# EAGLE design IRLocalization (EAGLE 9.6.2)
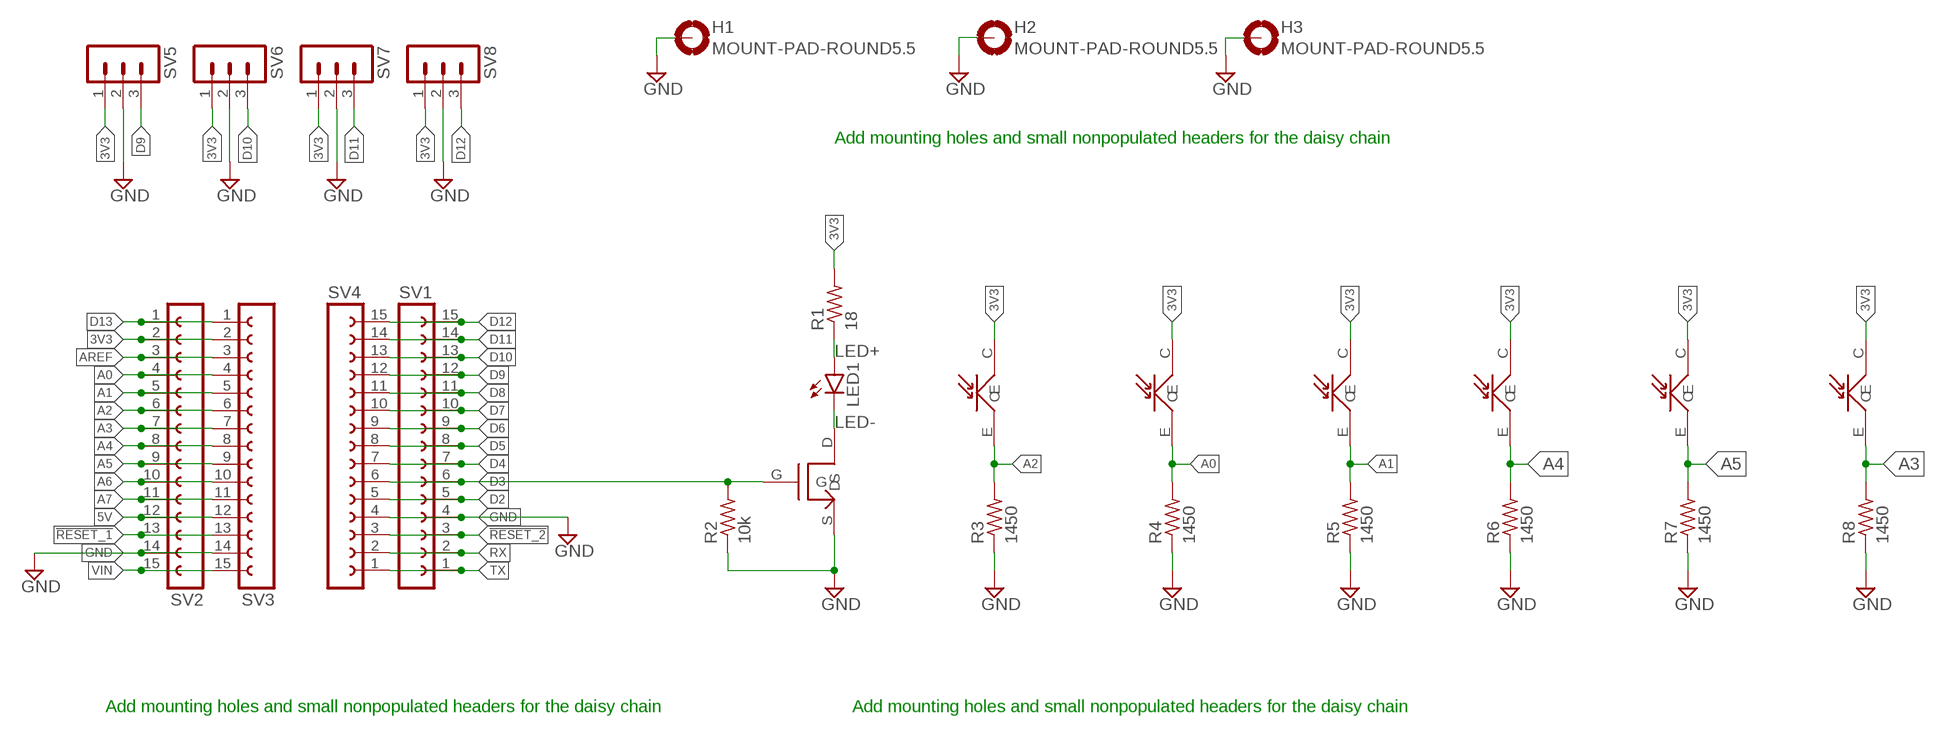
[diagram p0: schematic, sheet 1]

## Parts
H1  MOUNT-PAD-ROUND5.5  [5,5-PAD]
H2  MOUNT-PAD-ROUND5.5  [5,5-PAD]
H3  MOUNT-PAD-ROUND5.5  [5,5-PAD]
LED1  LED5MM  [LED5MM]
R1  18  R-US_R0603  [R0603]
R2  10k  R-US_R0603  [R0603]
R3  1450  R-US_R0603  [R0603]
R4  1450  R-US_R0603  [R0603]
R5  1450  R-US_R0603  [R0603]
R6  1450  R-US_R0603  [R0603]
R7  1450  R-US_R0603  [R0603]
R8  1450  R-US_R0603  [R0603]
SV1  FE15-1  [FE15]
SV2  FE15-1  [FE15]
SV3  FE15-1  [FE15]
SV4  FE15-1  [FE15]
SV5  MA03-1  [MA03-1]
SV6  MA03-1  [MA03-1]
SV7  MA03-1  [MA03-1]
SV8  MA03-1  [MA03-1]
U$1  NMOS_SOT23  [SOT23]
U$2  PHOTOTRANSISTOR_2.54  [2.54_TH]
U$3  PHOTOTRANSISTOR_2.54  [2.54_TH]
U$4  PHOTOTRANSISTOR_2.54  [2.54_TH]
U$5  PHOTOTRANSISTOR_2.54  [2.54_TH]
U$6  PHOTOTRANSISTOR_2.54  [2.54_TH]
U$7  PHOTOTRANSISTOR_2.54  [2.54_TH]

## Nets
3V3: R1.2 SV2.2 SV3.2 SV5.1 SV6.1 SV7.1 SV8.1 U$2.C U$3.C U$4.C U$5.C U$6.C U$7.C
5V: SV2.12 SV3.12
!RESET_1: SV2.13 SV3.13
!RESET_2: SV1.3 SV4.3
A0: R4.2 SV2.4 SV3.4 U$3.E
A1: R5.2 SV2.5 SV3.5 U$4.E
A2: R3.2 SV2.6 SV3.6 U$2.E
A3: R8.2 SV2.7 SV3.7 U$7.E
A4: R6.2 SV2.8 SV3.8 U$5.E
A5: R7.2 SV2.9 SV3.9 U$6.E
A6: SV2.10 SV3.10
A7: SV2.11 SV3.11
AREF: SV2.3 SV3.3
D2: SV1.5 SV4.5
D3: R2.2 SV1.6 SV4.6 U$1.G
D4: SV1.7 SV4.7
D5: SV1.8 SV4.8
D6: SV1.9 SV4.9
D7: SV1.10 SV4.10
D8: SV1.11 SV4.11
D9: SV1.12 SV4.12 SV5.3
D10: SV1.13 SV4.13 SV6.3
D11: SV1.14 SV4.14 SV7.3
D12: SV1.15 SV4.15 SV8.3
D13: SV2.1 SV3.1
GND: H1.B5,5(MOUNT) H2.B5,5(MOUNT) H3.B5,5(MOUNT) R2.1 R3.1 R4.1 R5.1 R6.1 R7.1 R8.1 SV1.4 SV2.14 SV3.14 SV4.4 SV5.2 SV6.2 SV7.2 SV8.2 U$1.S
LED+: LED1.A R1.1
LED-: LED1.K(C) U$1.D
RX: SV1.2 SV4.2
TX: SV1.1 SV4.1
VIN: SV2.15 SV3.15

## Notes on the sheet
- Add mounting holes and small nonpopulated headers for the daisy chain
- Add mounting holes and small nonpopulated headers for the daisy chain | Add mounting holes and small nonpopulated headers for the daisy chain

## Library data of the parts
H1-H3 = holes:MOUNT-PAD-ROUND: MOUNTING PAD, round
LED1 = led:LED: LED OSRAM: - CHIPLED LG R971, LG N971, LY N971, LG Q971, LY Q971, LO R971, LY R971 LH N974, LH R974 LS Q976, LO Q976, LY Q976 LO Q996 - Hyper CHIPLED LW Q18S LB Q993, LB Q99A, LB R99A - SideLED LS A670, LO A670, LY A670, LG A670, LP A670 LB A673, LV A673, LT A673, LW A673 LH A674 LY A675 LS A676, LA A676, LO A676, LY A676, LW A676 LS A679, LY A679, LG A679 - Hyper Micro SIDELED® LS Y876, LA Y876, LO Y876, LY Y876 LT Y87S - SmartLED LW L88C, LW L88S LB L89C, LB L89S, LG L890 LS L89K, LO L89K, LY L89K LS L896, LA L896, LO L896, LY L896 - TOPLED LS T670, LO T670, LY T670, LG T670, LP T670 LSG T670, LSP T670, LSY T670, LOP T670, LYG T670 LG T671, LOG T671, LSG T671 LB T673, LV T673, LT T673, LW T673 LH T674 LS T676, LA T676, LO T676, LY T676, LB T676, LH T676, LSB T676, LW T676 LB T67C, LV T67C, LT T67C, LS T67K, LO T67K, LY T67K, LW E67C LS E67B, LA E67B, LO E67B, LY E67B, LB E67C, LV E67C, LT E67C LW T67C LS T679, LY T679, LG T679 LS T770, LO T770, LY T770, LG T770, LP T770 LB T773, LV T773, LT T773, LW T773 LH T774 LS E675, LA E675, LY E675, LS T675 LS T776, LA T776, LO T776, LY T776, LB T776 LHGB T686 LT T68C, LB T68C - Hyper Mini TOPLED® LB M676 - Mini TOPLED Santana® LG M470 LS M47K, LO M47K, LY M47K Source: http://www.osram.convergy.de LUXEON: - LUMILED® LXK2-PW12-R00, LXK2-PW12-S00, LXK2-PW14-U00, LXK2-PW14-V00 LXK2-PM12-R00, LXK2-PM12-S00, LXK2-PM14-U00 LXK2-PE12-Q00, LXK2-PE12-R00, LXK2-PE12-S00, LXK2-PE14-T00, LXK2-PE14-U00 LXK2-PB12-K00, LXK2-PB12-L00, LXK2-PB12-M00, LXK2-PB14-N00, LXK2-PB14-P00, LXK2-PB14-Q00 LXK2-PR12-L00, LXK2-PR12-M00, LXK2-PR14-Q00, LXK2-PR14-R00 LXK2-PD12-Q00, LXK2-PD12-R00, LXK2-PD12-S00 LXK2-PH12-R00, LXK2-PH12-S00 LXK2-PL12-P00, LXK2-PL12-Q00, LXK2-PL12-R00 Source: www.luxeon.com KINGBRIGHT: KA-3528ASYC Source: www.kingbright.com
R1-R8 = resistor:R-US_: RESISTOR, American symbol
SV1-SV4 = con-lsta:FE15-1: FEMALE HEADER; OC_FARNELL: unknown; OC_NEWARK: unknown
SV5-SV8 = con-lstb:MA03-1: PIN HEADER; OC_FARNELL: unknown; OC_NEWARK: unknown
U$1 = IR_Localization:NMOS_SOT23
U$2-U$7 = IR_Localization:PHOTOTRANSISTOR_2.54

## Board
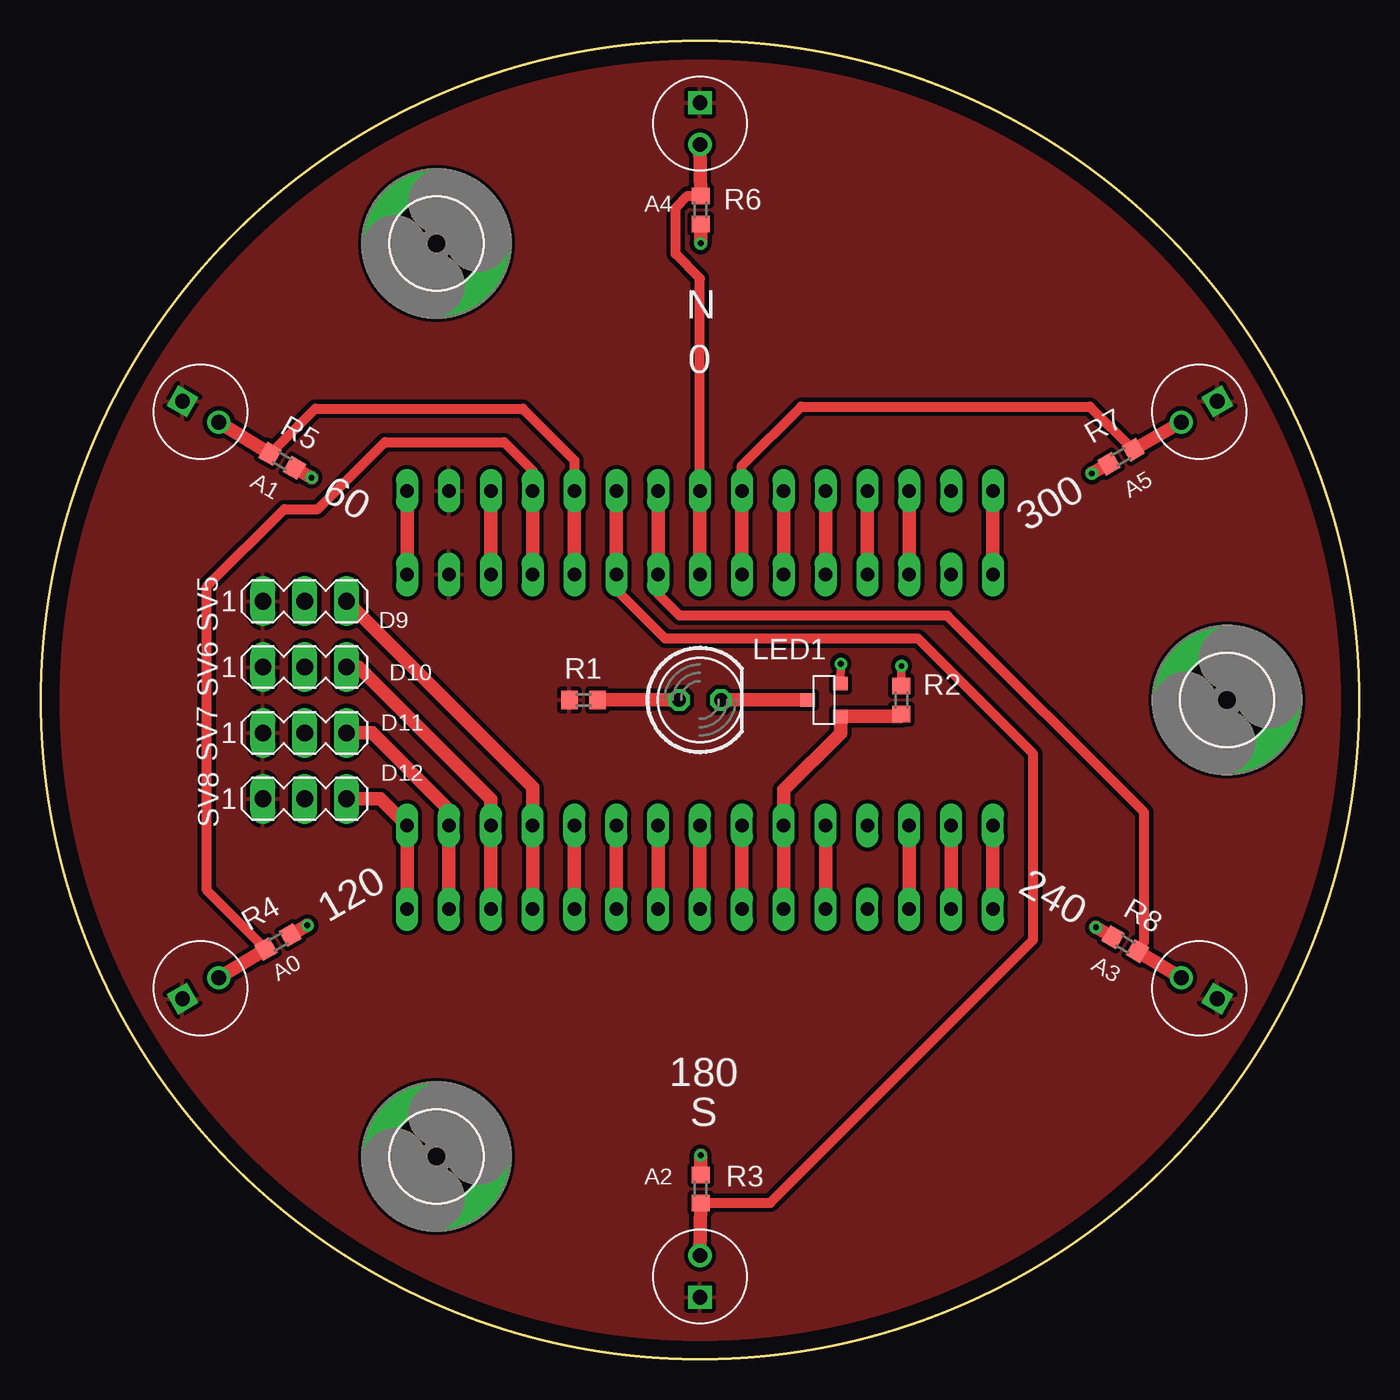
[diagram p1: board, top side]
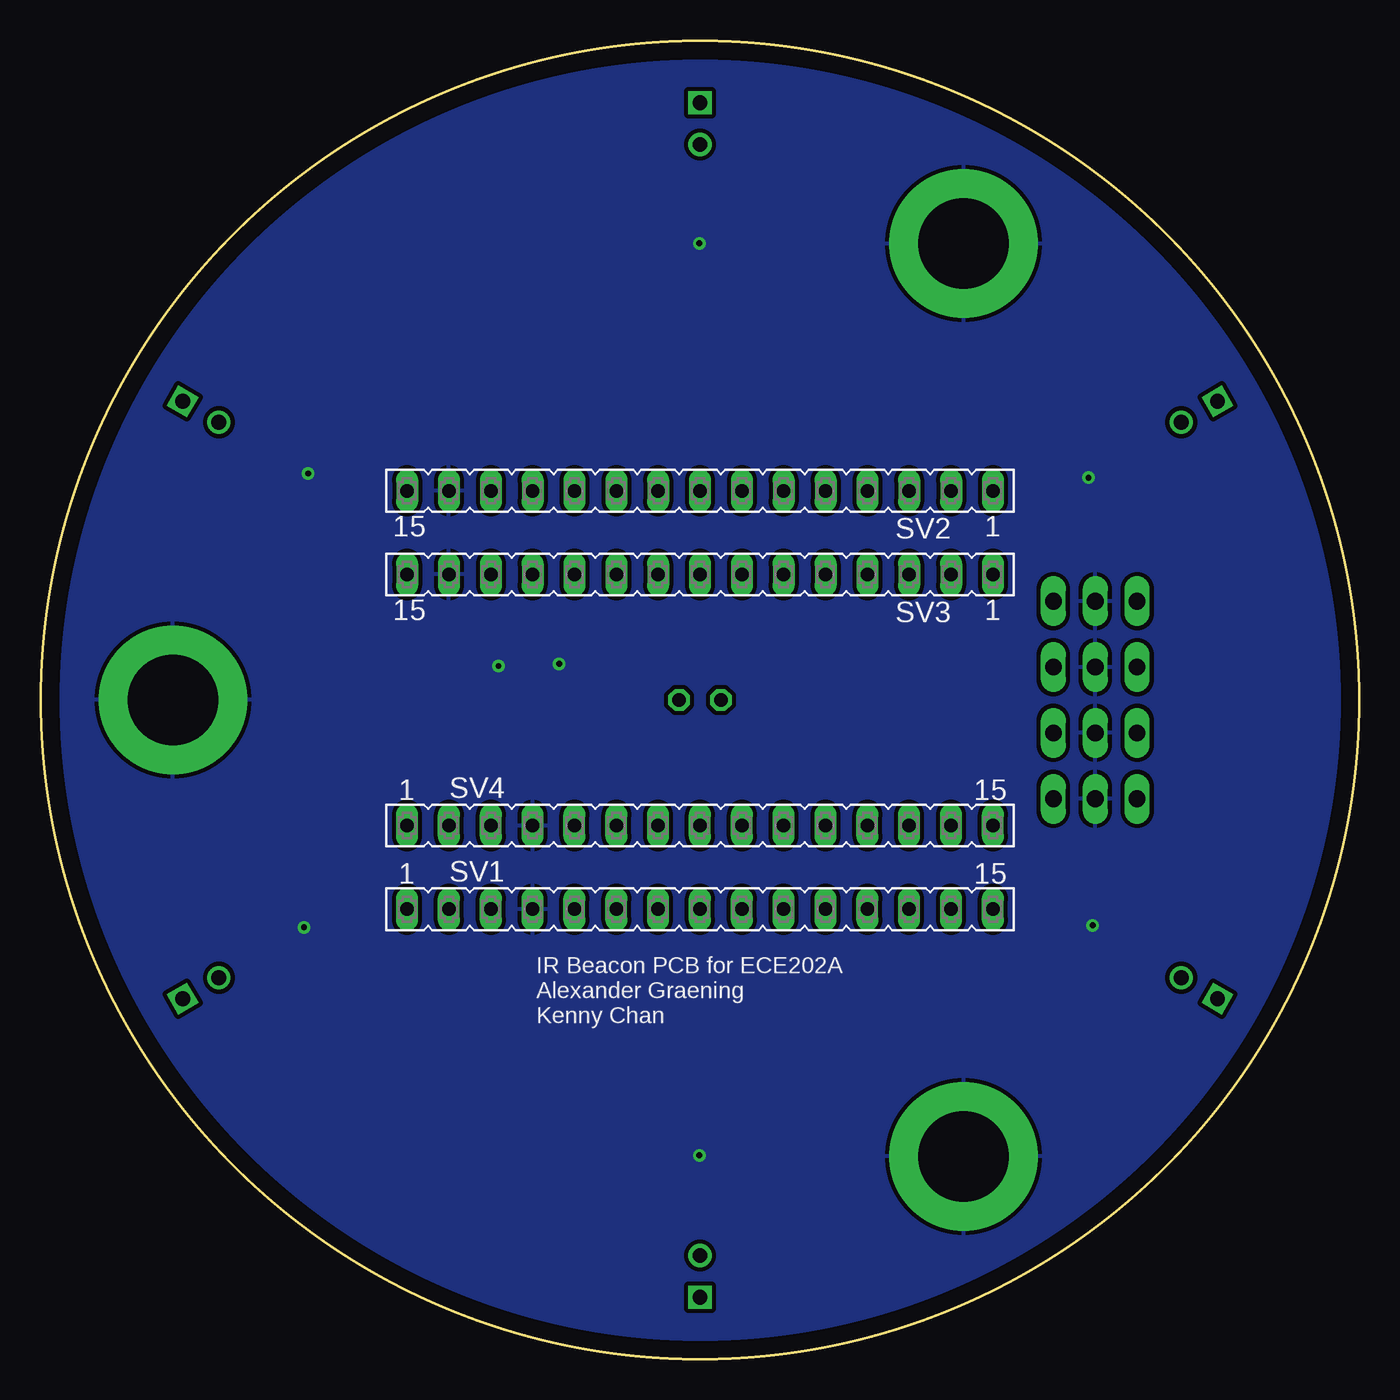
[diagram p2: board, bottom side, seen from below]

Size 80 x 80 mm. Coordinates in mm from the lower left corner, seen from the top.
Outline: circle at 40,40 radius 40
Copper layers (1*16): Top 0.035mm / dielectric 1.5mm / Bottom 0.035mm
Design rules "default *": minimum track width 6mil, minimum drill 0.35mm, track to track 10mil, track to pad 10mil, pad to pad 10mil, via to via 10mil, smd to smd 10mil, copper to edge 40mil, drill to drill 6mil, minimum pad ring 10mil, minimum via ring 8mil, stop-mask expansion 4mil, vias tented up to drill 0mil, thermal gap 10mil

### Footprints (pad centres in the part's own frame; a part is rotated, then mirrored left to right if it is on the bottom)
5,5-PAD = drill 5.5 pad 9: B5,5 0,0
LED5MM = drill 0.813 octagon: A -1.27,0; K 1.27,0
R0603 = smd 1 x 1.1: 1 -0.85,0; 2 0.85,0
FE15 = drill 0.813 long: 1 -17.78,0; 2 -15.24,0; 3 -12.7,0; 4 -10.16,0; 5 -7.62,0; 6 -5.08,0; 7 -2.54,0; 8 0,0; 9 2.54,0; 10 5.08,0; 11 7.62,0; 12 10.16,0; 13 12.7,0; 14 15.24,0; 15 17.78,0
MA03-1 = drill 1.016 long: 1 -2.54,0; 2 0,0; 3 2.54,0
SOT23 = smd 0.9 x 0.8: D -1,0; G 1,-1; S 1,1
2.54_TH = drill 0.9 square: C 0,1.27 | drill 0.9: E 0,-1.27

### Placement (x,y rotation side)
H1  24,12.29 0 top
H2  72,40 0 top
H3  24,67.71 0 top
LED1  40,40 0 top
R1  32.93,40 180 top
R2  52.23,40 270 top
R3  40.04,10.32 270 top
R4  14.38,25.31 210 top
R5  14.64,54.52 150 top
R6  40.04,69.76 90 top
R7  65.56,54.77 30 top
R8  65.82,25.18 330 top
SV1  40,27.3 0 bottom
SV2  40,52.7 180 bottom
SV3  40,47.62 180 bottom
SV4  40,32.38 0 bottom
SV5  16,46 0 top
SV6  16,42 0 top
SV7  16,38 0 top
SV8  16,34 0 top
U$1  47.53,40 0 top
U$2  40,5 180 top
U$3  9.68,22.5 120 top
U$4  9.68,57.5 60 top
U$5  40,75 0 top
U$6  70.31,57.5 300 top
U$7  70.31,22.5 240 top

### Tracks (layer width: path | path; a pad name or v marks a point on that pad's centre or on a via)
3V3
  pour Top: -0.09,40.04 -0.09,0.03 40.16,0.03 79.92,0.03 79.92,40.29 79.92,79.92 39.53,79.92 -0.09,79.92
5V
  Top 0.813: SV3.12 SV2.12
!RESET_1
  Top 0.813: SV2.13 SV3.13
!RESET_2
  Top 0.813: SV4.3 SV1.3
A0
  Top 0.61: R4.2 10.07,28.46 10.07,46.9 14.77,51.59 16.8,51.59 20.86,55.66 28.1,55.66 29.84,53.92 SV2.4
  Top 0.813: SV3.4 SV2.4 | U$3.E R4.2
A1
  Top 0.61: R5.2 16.65,57.69 29.24,57.69 32.38,54.55 SV2.5
  Top 0.813: SV2.5 SV3.5 | R5.2 U$4.E
A2
  Top 0.61: R3.2 44.27,9.47 60.23,25.43 60.23,36.74 53.25,43.72 37.88,43.72 34.92,46.68 SV3.6
  Top 0.813: SV3.6 SV2.6 | U$2.E R3.2
A3
  Top 0.61: R8.2 66.56,24.9 66.96,25.31 66.96,33.18 55.02,45.12 38.77,45.12 37.46,46.43 SV3.7
  Top 0.813: SV2.7 SV3.7 | U$7.E R8.2
A4
  Top 0.61: SV2.8 40,65.6 38.51,67.09 38.51,69.88 39.24,70.61 R6.2
  Top 0.813: R6.2 U$5.E | SV3.8 SV2.8
A5
  Top 0.61: SV2.9 42.54,54.22 46.13,57.82 63.68,57.82 R7.2
  Top 0.813: R7.2 U$6.E | SV3.9 SV2.9
A6
  Top 0.813: SV3.10 SV2.10
A7
  Top 0.813: SV2.11 SV3.11
AREF
  Top 0.813: SV2.3 SV3.3
D2
  Top 0.813: SV1.5 SV4.5
D3
  Top 0.508: 52.23,39 R2.2
  Top 0.813: 52.23,39 U$1.G 48.53,37.99 45.08,34.54 SV4.6 SV1.6
D4
  Top 0.813: SV1.7 SV4.7
D5
  Top 0.813: SV4.8 SV1.8
D6
  Top 0.813: SV1.9 SV4.9
D7
  Top 0.813: SV4.10 SV1.10
D8
  Top 0.813: SV1.11 SV4.11
D9
  Top 0.813: SV1.12 SV4.12 29.84,34.7 SV5.3
D10
  Top 0.813: SV1.13 SV4.13 27.3,33.98 19.28,42 SV6.3
D11
  Top 0.813: SV1.14 SV4.14 24.76,33.34 20.11,38 SV7.3
D12
  Top 0.813: SV1.15 SV4.15 20.6,34 SV8.3
D13
  Top 0.813: SV2.1 SV3.1
GND  (via drill 0.35)
  Top 0.508: R5.1 15.41,54.06 | U$1.S v48.55,42.2 | v52.23,42.07 R2.1
  Top 0.813: R4.1 v16.16,26.32 | R3.1 v40.04,12.35 | R8.1 v64.04,26.2 | R7.1 v63.79,53.75 | R6.1 v40.04,67.72 | v16.42,53.5 15.41,54.06
  pour Bottom: 0.03,79.92 0.03,0.03 80.04,0.03 80.04,79.92
LED+
  Top 0.813: LED1.A R1.1
LED-
  Top 0.813: LED1.K U$1.D
RX
  Top 0.813: SV1.2 SV4.2
TX
  Top 0.813: SV1.1 SV4.1
VIN
  Top 0.813: SV3.15 SV2.15

### Text on the board
tNames: A4 | N | 0 | A1 | 60 | A5 | 300 | D9 | D10 | D11 | D12 | 240 | 120 | A3 | A0 | 180 | S | A2
bNames: IR Beacon PCB for ECE202A / Alexander Graening / Kenny Chan